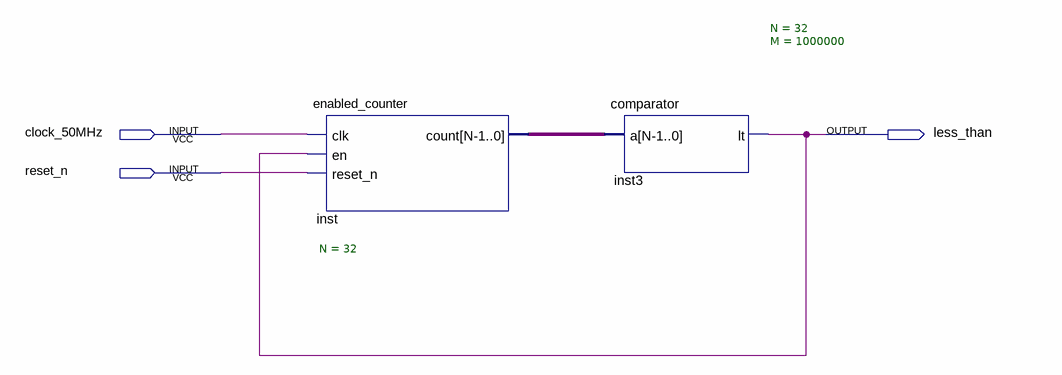
[diagram p0: schematic sheet]
// Quartus schematic turn_off.bdf as structural Verilog: 2 symbols, 3 pins
module turn_off (
  input  clock_50MHz,
  input  reset_n,
  output less_than
);

  wire [31:0] inst_count;

  enabled_counter #(.N(32)) inst (.clk(clock_50MHz), .en(less_than), .reset_n(reset_n), .count(inst_count));
  comparator #(.N(32), .M(1000000)) inst3 (.a(inst_count), .lt(less_than));
endmodule
